# Altium schematic sheet LiPo_Charger.SchDoc
size Legal; Author: Mark & Qiming; DocumentNumber: 6; SheetNumber: 6; SheetTotal: 9
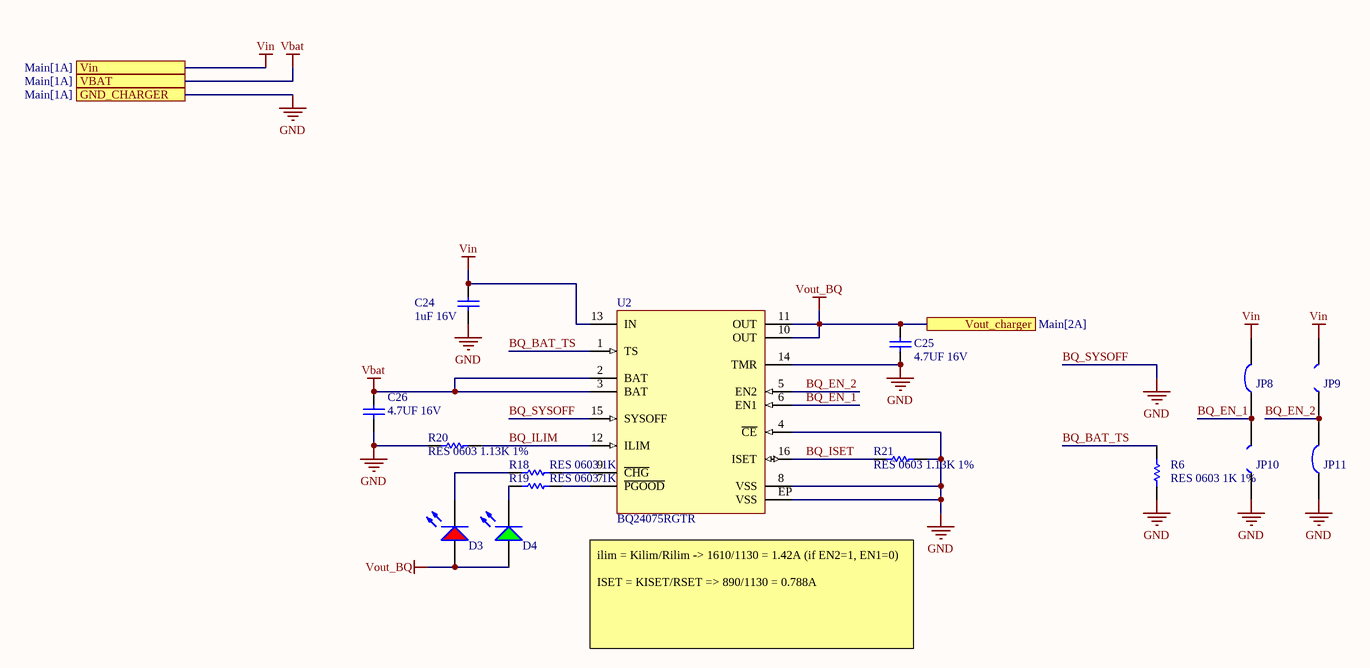
[diagram p0: LiPo_Charger.SchDoc]

## Parts
C24  1uF 16V  [0603_CAP]
C25  4.7UF 16V  [0805_CAP]
C26  4.7UF 16V  [0805_CAP]
D3  LSM0805412V  [LED_0805_RED]  (value not drawn)
D4  LSM0805452V  [LED_0805]  (value not drawn)
JP8  0603 link  [0603_JP_RES]  (value not drawn)  (net tie, no BOM)
JP9  0603 link (Open)  [0603_JP_Open]  (value not drawn)  (no BOM)
JP10  0603 link (Open)  [0603_JP_Open]  (value not drawn)  (no BOM)
JP11  0603 link  [0603_JP_RES]  (value not drawn)  (net tie, no BOM)
R6  RES 0603 1K 1%  [0603_RES]
R18  RES 0603 1K 1%  [0603_RES]
R19  RES 0603 1K 1%  [0603_RES]
R20  RES 0603 1.13K 1%  [0603_RES]
R21  RES 0603 1.13K 1%  [0603_RES]
U2  BQ24075RGTR  [FP-RGT0016C-IPC_A]

## Ports
GND_CHARGER (see Main[1A]), VBAT (see Main[1A]), Vin (see Main[1A]), Vout_charger (see Main[2A])

## Nets
BQ_SYSOFF: C24.1 C25.1 C26.1 JP10.1 JP11.2 R6.1 R20.1 R21.2 U2.4(~{CE}) U2.8(VSS) U2.14(TMR) U2.15(SYSOFF) U2.EP(VSS) ; port GND_CHARGER  [also labelled GND]
Vbat: C26.2 U2.2(BAT) U2.3(BAT) ; port VBAT
Vin: C24.2 JP8.2 JP9.1 U2.13(IN) ; port Vin
Vout_BQ: C25.2 D3.A D4.A U2.10(OUT) U2.11(OUT) ; port Vout_charger
BQ_BAT_TS: R6.2 U2.1(TS)
BQ_EN_1: JP8.1 JP10.2 U2.6(EN1)
BQ_EN_2: JP9.2 JP11.1 U2.5(EN2)
BQ_ILIM: R20.2 U2.12(ILIM)
BQ_ISET: R21.1 U2.16(ISET)
NetD3_K: D3.K R18.2
NetD4_K: D4.K R19.2
NetR18_1: R18.1 U2.9(~{CHG})
NetR19_1: R19.1 U2.7(~{PGOOD})

## Notes on the sheet
- (near U2) ilim = Kilim/Rilim -> 1610/1130 = 1.42A (if EN2=1, EN1=0)
  ISET = KISET/RSET => 890/1130 = 0.788A
- Title:
- Desc:
- Size:
- Letter
- Auth:
- Proj:
- Sheet
- of
- www.seas.upenn.edu
- Electrical and Systems Engineering

## Library data of the parts
C24 = CMP-011-000286-1: Capacitor Surface Mount 0603 Footprint 1UF 16V 10% Tolerance Ceramic X7R; Manufacturer: Various; P/N: CAP 0603 1UF 16V 10% X7R; PCB Package: 0603; Description in Visual: Cap SMT 0603 1UF 16V 10% Ceramic X7R; Manufacturer P/N: CAP 0603 1UF 16V 10% X7R; Tolerance: 10%; Type: Ceramic X7R; Value: 1UF; Mount: SMT; Voltage: 16V
C25 C26 = CMP-011-000523-1: Capacitor Surface Mount 0805 Footprint 4.7UF 16V 10% Tolerance Ceramic X7R; Manufacturer P/N: CAP 0805 4.7UF 16V 10% X7R; Manufacturer: Various; PCB Package: 0805; Description in Visual: Cap SMT 0805 4.7UF 16V 10%  Cer X7R; Mount: SMT; P/N: CAP 0805 4.7UF 16V 10% X7R; Type: Ceramic X7R; Voltage: 16V; Tolerance: 10%; Value: 4.7UF
D3 = CMP-00026-00001-1: Single Color LED, RED, 0805; Test Current: 20mA; Forward Voltage: 2V; RoHS Compliant: Yes
D4 = CMP-00038-3: Single Color LED, Green, 0805; Test Current: 20mA; Forward Voltage: 2V; RoHS Compliant: Yes
JP8 JP11 = CMP-00422-2: 0O link, SMD, 0603, Solder Bridge Option; Manufacturer P/N: Various; Manufacturer: Generic; Description in Visual: 0O link, Solder Bridge/SMD, Open; Value: 0.025; Source: Shunts and Jumpers.SchLib; Pin Count: 2; Design Item ID: 0603 link; Component Type: Net Tie; P/N: 0603 link
JP9 JP10 = CMP-00423-2: 0O link, Solder Bridge/SMD, Open; Value: 10000000000meg; P/N: 0603 link (Open); Description in Visual: 0O link, Solder Bridge/SMD, Open; Component Type: Standard (No BOM); Design Item ID: 0603 link (Open); Pin Count: 2; Source: Shunts and Jumpers.SchLib
R6 R18 R19 = CMP-005-002503-3: Resistor Surface Mount, 1K Ohms, 0603 Footprint, 1% Tolerance 0.1W; Manufacturer: Various; PCB Package: 0603; Description in Visual: Res SMT 1K 0603  1%  0.1W; Tolerance: 1%; Value: 1k; Mount: SMT; Power Rating: 0.1W; Manufacturer P/N: RES 0603 1K 1%; JLCPCB Part #: C21190
R20 R21 = CMP-005-001984-2: Resistor Surface Mount, 1.13K Ohms, 0603 Footprint, 1% Tolerance 0.1W; Manufacturer: Various; Description in Visual: Res SMT 1.13K 0603  1%  0.1W; PCB Package: 0603; Power Rating: 0.1W; Mount: SMT; Tolerance: 1%; Manufacturer P/N: RES 0603 1.13K 1%; Value: 1.13k
U2 = CMP-00080-5: Power Supply Support Circuit, Adjustable, 1 Channel, 6.6, PQCC16; Nominal Supply Voltage: 5V; Channels: 1; Min Supply Voltage: 4.35V; Qualification Status: Not Qualified; Power Supplies: 4.5/6.3V; Package Equivalence Code: LCC16,.12SQ,20; Adjustable Threshold: Yes; Package Body Material: Plastic; Max Supply Voltage: 26V; Supply Current-Max (Isup): 1.5mA; Reach SVHC Compliant: Yes; RoHS Compliant: Yes; Throw Configuration: POWER SUPPLY SUPPORT CIRCUIT; Moisture Sensitivity Level: 2; Min Operating Temperature: -40°C; JESD-609 Code: e4; Width: 3mm; Terminal Form: No Lead; Terminal Finish: Nickel; Terminal Position: QUAD; Height - Seated (Max): 1mm; Temperature Grade: INDUSTRIAL; Case/Package: HVQCCN; Length: 3mm; Max Operating Temperature: 85°C; Peak Reflow Temperature (Cel): 260°C; Number of Channels: 1; Package Shape: Square; Package Style: CHIP CARRIER, HEAT SINK/SLUG, VERY THIN PROFILEMeter; Surface Mount: Yes; Pins: 16; JESD-30 Code: S-PQCC-N16; Terminal Pitch: 0.5mm